# Altium schematic sheet Button.SchDoc
size A3
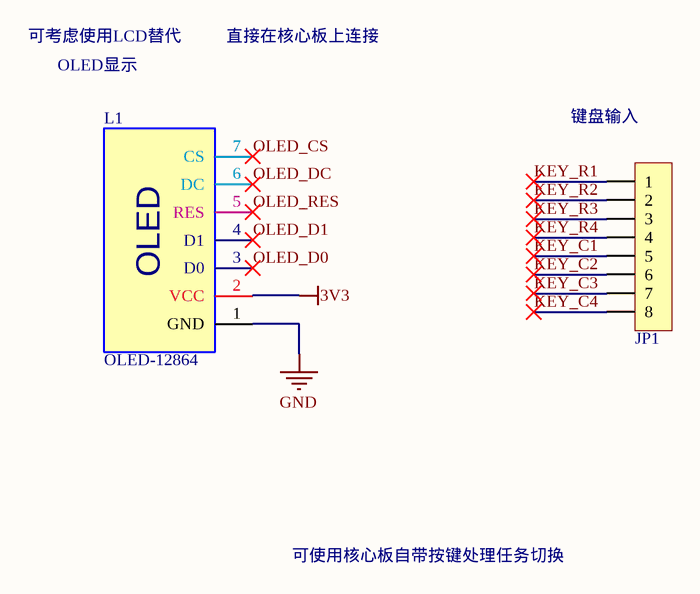
[diagram p0: Button.SchDoc]

## Parts
JP1  HDR-1X8  [HDR2.54-M-LI-8P]  (value not drawn)
L1  OLED-12864  [OLED-12864]

## Nets
3V3: L1.2(VCC)
GND: L1.1(GND)
KEY_C1: JP1.5
KEY_C2: JP1.6
KEY_C3: JP1.7
KEY_C4: JP1.8
KEY_R1: JP1.1
KEY_R2: JP1.2
KEY_R3: JP1.3
KEY_R4: JP1.4
OLED_CS: L1.7(CS)
OLED_D0: L1.3(D0)
OLED_D1: L1.4(D1)
OLED_DC: L1.6(DC)
OLED_RES: L1.5(RES)

## Notes on the sheet
- 可考虑使用LCD替代
- OLED显示
- 直接在核心板上连接
- (near JP1) 键盘输入
- 可使用核心板自带按键处理任务切换
- (in symbol OLED-12864) OLED

## Library data of the parts
JP1 = Header 8: 8P接插件; 版权归属: 源创客; BOM名称: 8P接插件; 学习资源: www.ooocke.com